# EasyEDA Pro project ProPrj_外接板20260112_2026-01-12.epro, schematic Schematic1
Board Name: Board1; Create Date: 2026-01-12; Page Name: P1; Project Name: 外接板20260112; Schematic Name: Schematic1; Update Date: 2026-01-12; Company: 嘉立创EDA; Page Size: A4; Version: V1.0
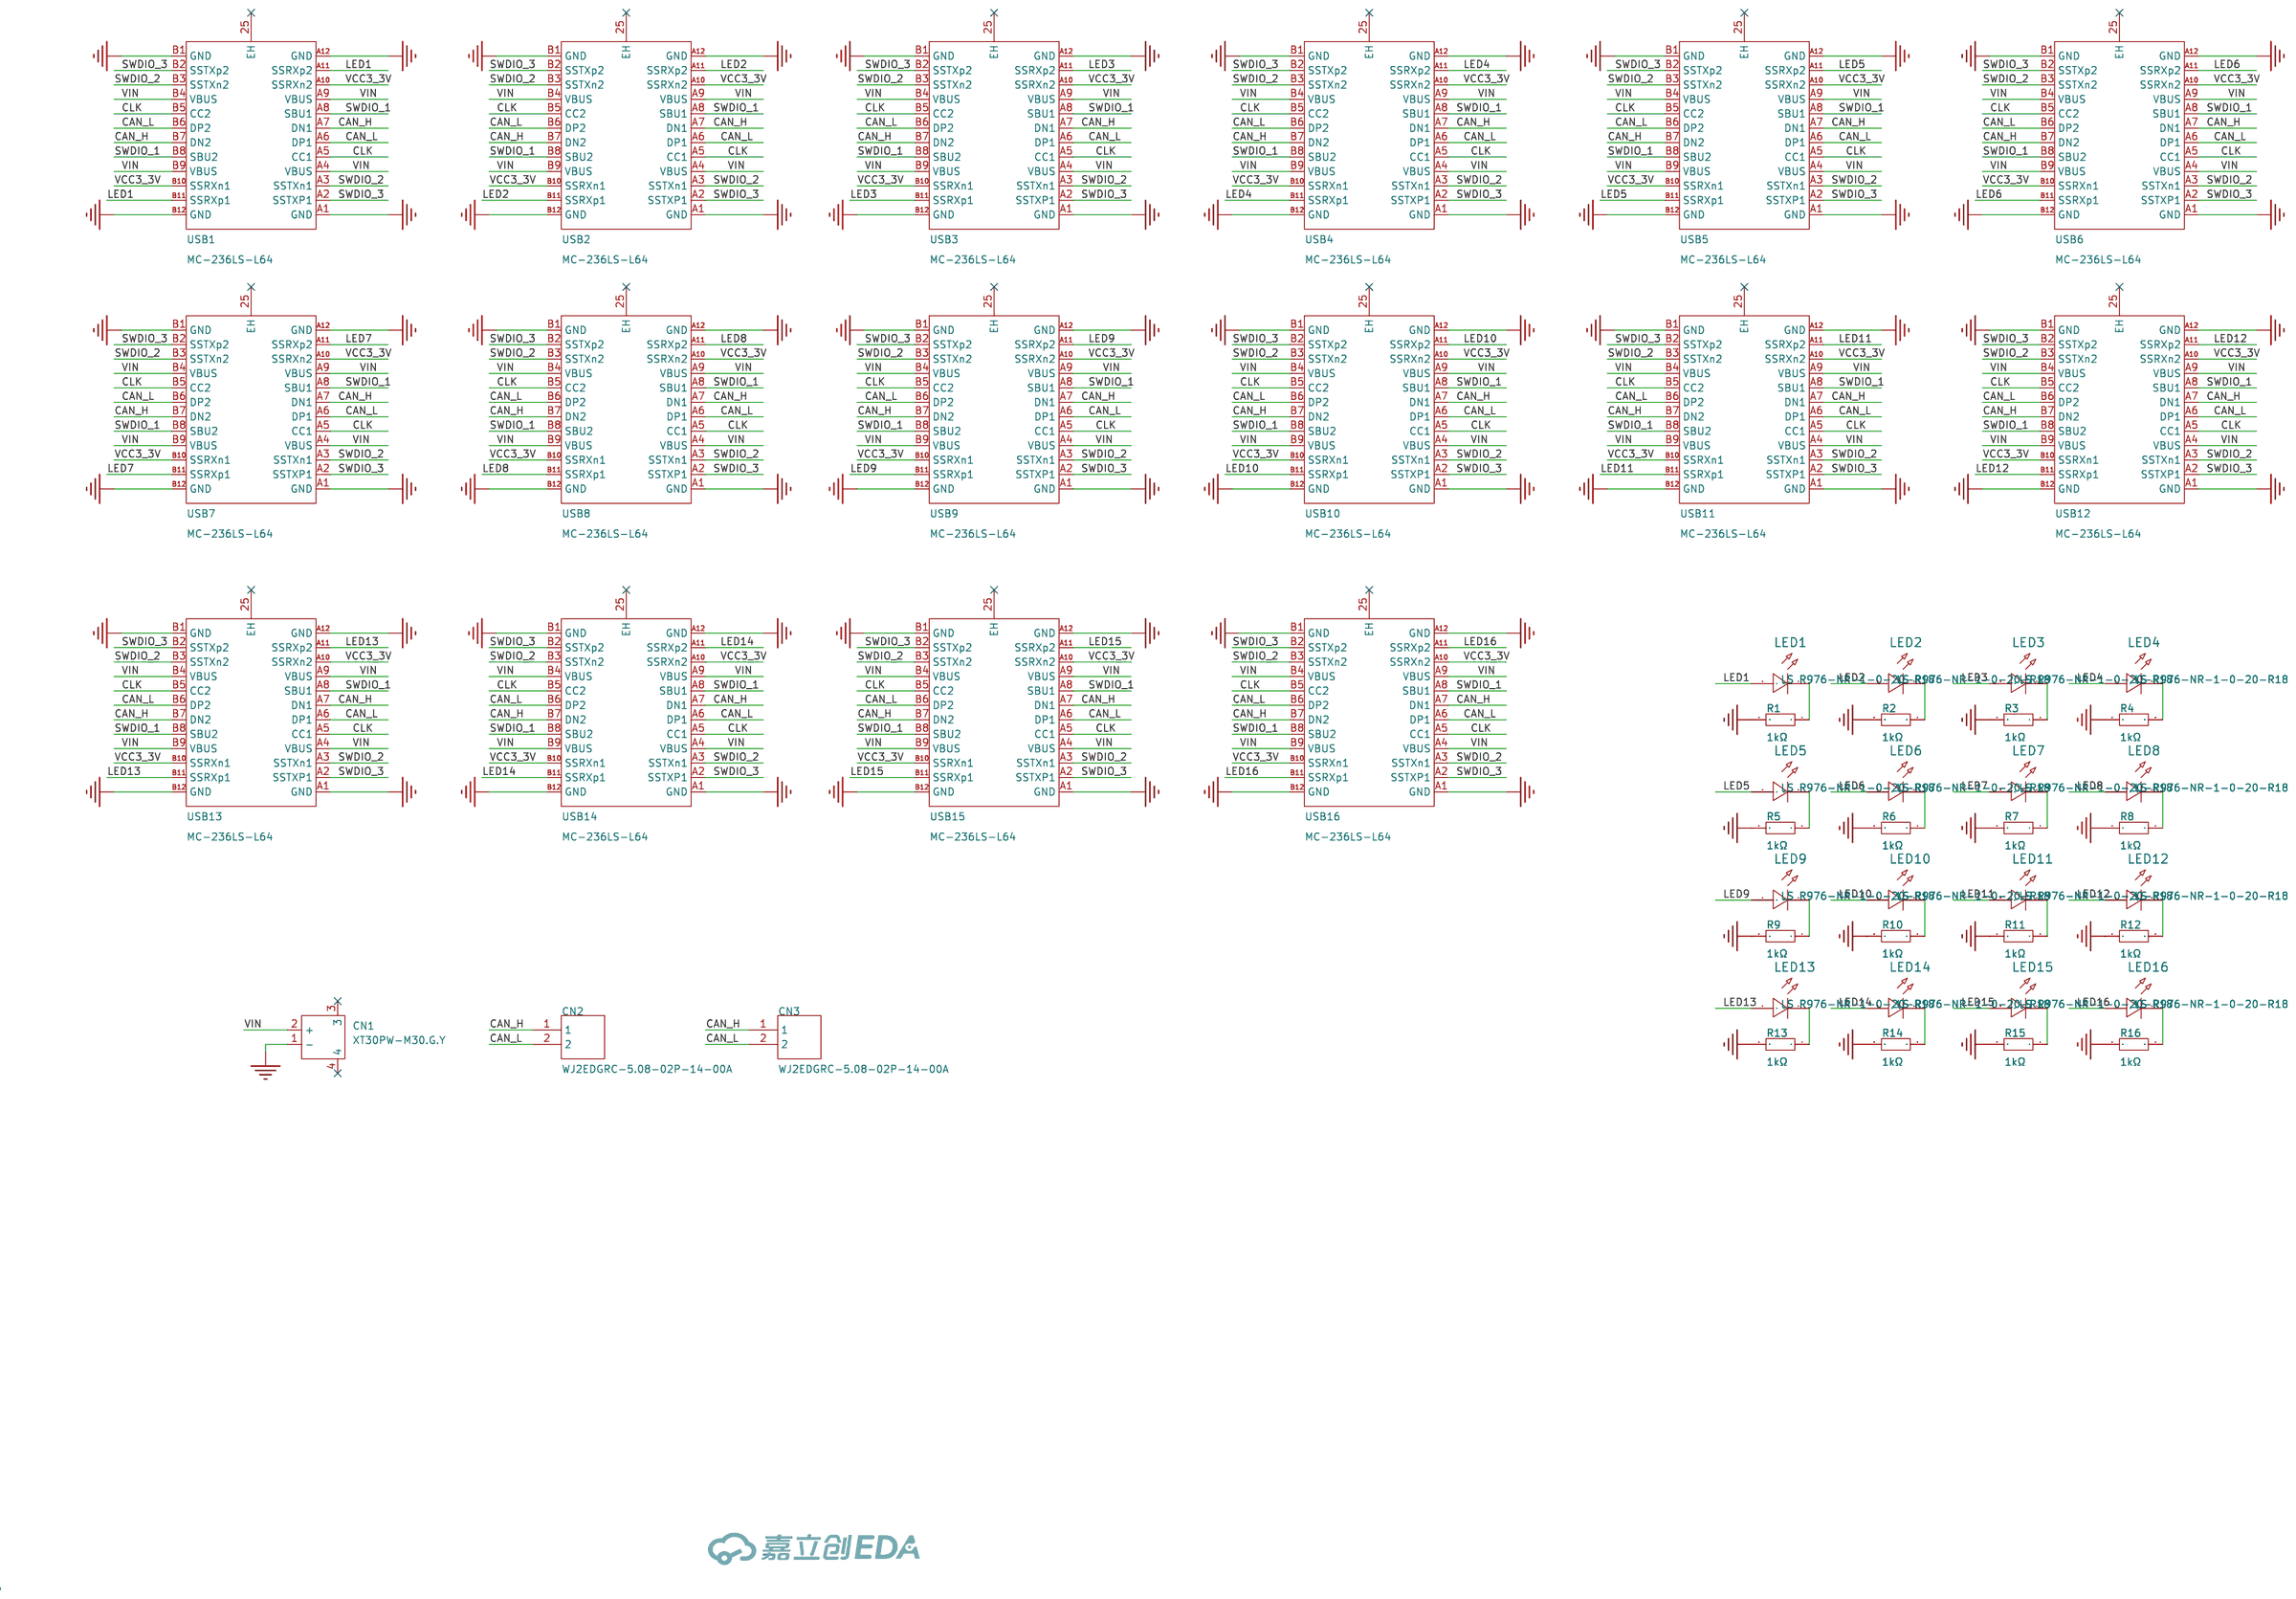
[diagram p0: schematic sheet]

## Parts
CN1  XT30PW-M30.G.Y  [CONN-TH_XT30PW-M]
CN2  WJ2EDGRC-5.08-02P-14-00A  [CONN-TH_2P-P5.08_WJ2EDGRC-5.08-2P]
CN3  WJ2EDGRC-5.08-02P-14-00A  [CONN-TH_2P-P5.08_WJ2EDGRC-5.08-2P]
LED1  LS R976-NR-1-0-20-R18  [LED0805-RD_RED]
LED2  LS R976-NR-1-0-20-R18  [LED0805-RD_RED]
LED3  LS R976-NR-1-0-20-R18  [LED0805-RD_RED]
LED4  LS R976-NR-1-0-20-R18  [LED0805-RD_RED]
LED5  LS R976-NR-1-0-20-R18  [LED0805-RD_RED]
LED6  LS R976-NR-1-0-20-R18  [LED0805-RD_RED]
LED7  LS R976-NR-1-0-20-R18  [LED0805-RD_RED]
LED8  LS R976-NR-1-0-20-R18  [LED0805-RD_RED]
LED9  LS R976-NR-1-0-20-R18  [LED0805-RD_RED]
LED10  LS R976-NR-1-0-20-R18  [LED0805-RD_RED]
LED11  LS R976-NR-1-0-20-R18  [LED0805-RD_RED]
LED12  LS R976-NR-1-0-20-R18  [LED0805-RD_RED]
LED13  LS R976-NR-1-0-20-R18  [LED0805-RD_RED]
LED14  LS R976-NR-1-0-20-R18  [LED0805-RD_RED]
LED15  LS R976-NR-1-0-20-R18  [LED0805-RD_RED]
LED16  LS R976-NR-1-0-20-R18  [LED0805-RD_RED]
R1  1kΩ  [R0805]
R2  1kΩ  [R0805]
R3  1kΩ  [R0805]
R4  1kΩ  [R0805]
R5  1kΩ  [R0805]
R6  1kΩ  [R0805]
R7  1kΩ  [R0805]
R8  1kΩ  [R0805]
R9  1kΩ  [R0805]
R10  1kΩ  [R0805]
R11  1kΩ  [R0805]
R12  1kΩ  [R0805]
R13  1kΩ  [R0805]
R14  1kΩ  [R0805]
R15  1kΩ  [R0805]
R16  1kΩ  [R0805]
USB1  MC-236LS-L64  [TYPE-C-USB-SMD_TYPE-C-31-M-06]
USB2  MC-236LS-L64  [TYPE-C-USB-SMD_TYPE-C-31-M-06]
USB3  MC-236LS-L64  [TYPE-C-USB-SMD_TYPE-C-31-M-06]
USB4  MC-236LS-L64  [TYPE-C-USB-SMD_TYPE-C-31-M-06]
USB5  MC-236LS-L64  [TYPE-C-USB-SMD_TYPE-C-31-M-06]
USB6  MC-236LS-L64  [TYPE-C-USB-SMD_TYPE-C-31-M-06]
USB7  MC-236LS-L64  [TYPE-C-USB-SMD_TYPE-C-31-M-06]
USB8  MC-236LS-L64  [TYPE-C-USB-SMD_TYPE-C-31-M-06]
USB9  MC-236LS-L64  [TYPE-C-USB-SMD_TYPE-C-31-M-06]
USB10  MC-236LS-L64  [TYPE-C-USB-SMD_TYPE-C-31-M-06]
USB11  MC-236LS-L64  [TYPE-C-USB-SMD_TYPE-C-31-M-06]
USB12  MC-236LS-L64  [TYPE-C-USB-SMD_TYPE-C-31-M-06]
USB13  MC-236LS-L64  [TYPE-C-USB-SMD_TYPE-C-31-M-06]
USB14  MC-236LS-L64  [TYPE-C-USB-SMD_TYPE-C-31-M-06]
USB15  MC-236LS-L64  [TYPE-C-USB-SMD_TYPE-C-31-M-06]
USB16  MC-236LS-L64  [TYPE-C-USB-SMD_TYPE-C-31-M-06]

## Library data of the parts
CN1 = XT30PW-M30.G.Y: 类别:-;类型1:-;; LCSC Part Name: AMASS(艾迈斯)航模插头 卧式弯脚 XT30PW-M公头; Supplier Part: C431092; Manufacturer: AMASS(艾迈斯); JLCPCB Part Class: 扩展库; Datasheet: https://item.szlcsc.com/datasheet/XT30PW-M30.G.Y/426930.html; Supplier: LCSC; Type: 航模插头; RatedVoltage: DC 500V; InterfaceType: 公头; RatedCurrent: 15A; RecommendedWireGauge: 16/18/20AWG; contact resistance: 1.2mΩ; specifications: 2pin
CN2 CN3 = WJ2EDGRC-5.08-2P: 连接器类型:板端/插座-闭口;固定方式:卡扣固定;结构:1x2P;间距:5.08mm;颜色:绿色;安装方式:弯针;排数:1;每排PIN数:2;额定电流:10A;额定电压:300V;线规 - AWG:-;线规 - 平方毫米:-;工作温度:-40℃~+105℃;; LCSC Part Name: 卡扣固定 1x2P 5.08mm 排数:1 每排P数:2; Supplier Part: C3697; Manufacturer: KANGNEX(康奈克斯电气); Supplier Footprint: 弯插,P=5.08mm; JLCPCB Part Class: Extended Part; Datasheet: https://item.szlcsc.com/datasheet/WJ2EDGRC-5.08-02P-14-00A/4099.html; Supplier: LCSC; Connector Type: 板端/插座-闭口; Structure: 1x2P; Pitch: 5.08mm; Color: 绿色; Mounting Style: 弯针; Number of Pins: 2P; Number of Rows: 1; Number of PINs Per Row: 2; Current Rating (Max): 20A; Voltage Rating (Max): 300V; Contact Material: 黄铜; Contact Plating: 锡; Operating Temperature Range: -40℃~+105℃; Termination Style: 卡扣固定; Number of Positions or Pins: 1x2P; Mounting Type: 弯针; Current Rating: 10A; Operating Temperature: -40℃~+105℃
LED1-LED16 = LS R976-NR-1-0-20-R18: 发光颜色:红色;正向压降(Vf):2V;正向电流:20mA;波长:625nm~650nm;透镜颜色:雾状白色透镜;发光强度:180mcd;发光角度:160°;工作温度:-30℃~+85℃;; LCSC Part Name: 0805红(雾状); Supplier Part: C2899997; Manufacturer: OSRAM(欧司朗); Supplier Footprint: 0805; JLCPCB Part Class: Extended Part; Datasheet: https://item.szlcsc.com/datasheet/LS%2520R976-NR-1-0-20-R18/3147924.html; Supplier: LCSC; Illumination Color: 红色; Voltage - Forward(Vf): 2V; Forward Current: 20mA; Wavelength - Dominant: 625nm~650nm; Peak Wavelength: 645nm; Lens Color: 雾状白色透镜; Luminous Intensity: 180mcd; Viewing Angle: 160°; Operating Temperature: -30℃~+85℃
R1-R16 = 0805W8F1001T5E: 电阻类型:厚膜电阻;阻值:1kΩ;精度:±1%;功率:125mW;最大工作电压:150V;温度系数:±100ppm/℃;; LCSC Part Name: 1kΩ ±1% 125mW 厚膜电阻; Supplier Part: C17513; Manufacturer: UNI-ROYAL(厚声); Supplier Footprint: 0805; JLCPCB Part Class: Basic Part; Datasheet: https://atta.szlcsc.com/upload/public/pdf/source/20200306/C422600_1E6D84923E4A46A82E41ADD87F860B5C.pdf; Supplier: LCSC; Type: 厚膜电阻; Tolerance: ±1%; Power(Watts): 125mW; Overload Voltage (Max): 150V; Temperature Coefficient: ±100ppm/℃; Operating Temperature Range: -55℃~+155℃
USB1-USB16 = MC-236LS-L64: 连接器类型:Type-C;协议标准:USB 3.1;公母:母;安装方式:立贴;触点数量:24P;端口数量:1;额定电流 - 电源:5A;工作温度:-25℃~+85℃;; LCSC Part Name: Type-C 母 立贴; Supplier Part: C3039314; Manufacturer: HANBO(汉博); Supplier Footprint: SMD; JLCPCB Part Class: 扩展库; Datasheet: https://item.szlcsc.com/datasheet/MC-236LS-L64/3592990.html; Supplier: LCSC; Connector Type: Type-C; Protocol Standard: USB 3.1; Gender: 母; Mounting Type: 立贴; Number of Contacts: 24P; Number of Ports: 1; Current Rating-Power: 5A; Voltage Rating: 5V; Connect-Disconnect Life: 1万次; Operating Temperature: -25℃~+85℃

## Nets
GND: CN1.1(-) R1.2 R2.2 R3.2 R4.2 R5.2 R6.2 R7.2 R8.2 R9.2 R10.2 R11.2 R12.2 R13.2 R14.2 R15.2 R16.2 USB1.A1(GND) USB1.A12(GND) USB1.B1(GND) USB1.B12(GND) USB2.A1(GND) USB2.A12(GND) USB2.B1(GND) USB2.B12(GND) USB3.A1(GND) USB3.A12(GND) USB3.B1(GND) USB3.B12(GND) USB4.A1(GND) USB4.A12(GND) USB4.B1(GND) USB4.B12(GND) USB5.A1(GND) USB5.A12(GND) USB5.B1(GND) USB5.B12(GND) USB6.A1(GND) USB6.A12(GND) USB6.B1(GND) USB6.B12(GND) USB7.A1(GND) USB7.A12(GND) USB7.B1(GND) USB7.B12(GND) USB8.A1(GND) USB8.A12(GND) USB8.B1(GND) USB8.B12(GND) USB9.A1(GND) USB9.A12(GND) USB9.B1(GND) USB9.B12(GND) USB10.A1(GND) USB10.A12(GND) USB10.B1(GND) USB10.B12(GND) USB11.A1(GND) USB11.A12(GND) USB11.B1(GND) USB11.B12(GND) USB12.A1(GND) USB12.A12(GND) USB12.B1(GND) USB12.B12(GND) USB13.A1(GND) USB13.A12(GND) USB13.B1(GND) USB13.B12(GND) USB14.A1(GND) USB14.A12(GND) USB14.B1(GND) USB14.B12(GND) USB15.A1(GND) USB15.A12(GND) USB15.B1(GND) USB15.B12(GND) USB16.A1(GND) USB16.A12(GND) USB16.B1(GND) USB16.B12(GND)
VCC3_3V: USB1.A10(SSRXn2) USB1.B10(SSRXn1) USB2.A10(SSRXn2) USB2.B10(SSRXn1) USB3.A10(SSRXn2) USB3.B10(SSRXn1) USB4.A10(SSRXn2) USB4.B10(SSRXn1) USB5.A10(SSRXn2) USB5.B10(SSRXn1) USB6.A10(SSRXn2) USB6.B10(SSRXn1) USB7.A10(SSRXn2) USB7.B10(SSRXn1) USB8.A10(SSRXn2) USB8.B10(SSRXn1) USB9.A10(SSRXn2) USB9.B10(SSRXn1) USB10.A10(SSRXn2) USB10.B10(SSRXn1) USB11.A10(SSRXn2) USB11.B10(SSRXn1) USB12.A10(SSRXn2) USB12.B10(SSRXn1) USB13.A10(SSRXn2) USB13.B10(SSRXn1) USB14.A10(SSRXn2) USB14.B10(SSRXn1) USB15.A10(SSRXn2) USB15.B10(SSRXn1) USB16.A10(SSRXn2) USB16.B10(SSRXn1)
VIN: CN1.2(+) USB1.A4(VBUS) USB1.A9(VBUS) USB1.B4(VBUS) USB1.B9(VBUS) USB2.A4(VBUS) USB2.A9(VBUS) USB2.B4(VBUS) USB2.B9(VBUS) USB3.A4(VBUS) USB3.A9(VBUS) USB3.B4(VBUS) USB3.B9(VBUS) USB4.A4(VBUS) USB4.A9(VBUS) USB4.B4(VBUS) USB4.B9(VBUS) USB5.A4(VBUS) USB5.A9(VBUS) USB5.B4(VBUS) USB5.B9(VBUS) USB6.A4(VBUS) USB6.A9(VBUS) USB6.B4(VBUS) USB6.B9(VBUS) USB7.A4(VBUS) USB7.A9(VBUS) USB7.B4(VBUS) USB7.B9(VBUS) USB8.A4(VBUS) USB8.A9(VBUS) USB8.B4(VBUS) USB8.B9(VBUS) USB9.A4(VBUS) USB9.A9(VBUS) USB9.B4(VBUS) USB9.B9(VBUS) USB10.A4(VBUS) USB10.A9(VBUS) USB10.B4(VBUS) USB10.B9(VBUS) USB11.A4(VBUS) USB11.A9(VBUS) USB11.B4(VBUS) USB11.B9(VBUS) USB12.A4(VBUS) USB12.A9(VBUS) USB12.B4(VBUS) USB12.B9(VBUS) USB13.A4(VBUS) USB13.A9(VBUS) USB13.B4(VBUS) USB13.B9(VBUS) USB14.A4(VBUS) USB14.A9(VBUS) USB14.B4(VBUS) USB14.B9(VBUS) USB15.A4(VBUS) USB15.A9(VBUS) USB15.B4(VBUS) USB15.B9(VBUS) USB16.A4(VBUS) USB16.A9(VBUS) USB16.B4(VBUS) USB16.B9(VBUS)
CAN_H: CN2.1 CN3.1 USB1.A7(DN1) USB1.B7(DN2) USB2.A7(DN1) USB2.B7(DN2) USB3.A7(DN1) USB3.B7(DN2) USB4.A7(DN1) USB4.B7(DN2) USB5.A7(DN1) USB5.B7(DN2) USB6.A7(DN1) USB6.B7(DN2) USB7.A7(DN1) USB7.B7(DN2) USB8.A7(DN1) USB8.B7(DN2) USB9.A7(DN1) USB9.B7(DN2) USB10.A7(DN1) USB10.B7(DN2) USB11.A7(DN1) USB11.B7(DN2) USB12.A7(DN1) USB12.B7(DN2) USB13.A7(DN1) USB13.B7(DN2) USB14.A7(DN1) USB14.B7(DN2) USB15.A7(DN1) USB15.B7(DN2) USB16.A7(DN1) USB16.B7(DN2)
CAN_L: CN2.2 CN3.2 USB1.A6(DP1) USB1.B6(DP2) USB2.A6(DP1) USB2.B6(DP2) USB3.A6(DP1) USB3.B6(DP2) USB4.A6(DP1) USB4.B6(DP2) USB5.A6(DP1) USB5.B6(DP2) USB6.A6(DP1) USB6.B6(DP2) USB7.A6(DP1) USB7.B6(DP2) USB8.A6(DP1) USB8.B6(DP2) USB9.A6(DP1) USB9.B6(DP2) USB10.A6(DP1) USB10.B6(DP2) USB11.A6(DP1) USB11.B6(DP2) USB12.A6(DP1) USB12.B6(DP2) USB13.A6(DP1) USB13.B6(DP2) USB14.A6(DP1) USB14.B6(DP2) USB15.A6(DP1) USB15.B6(DP2) USB16.A6(DP1) USB16.B6(DP2)
CLK: USB1.A5(CC1) USB1.B5(CC2) USB2.A5(CC1) USB2.B5(CC2) USB3.A5(CC1) USB3.B5(CC2) USB4.A5(CC1) USB4.B5(CC2) USB5.A5(CC1) USB5.B5(CC2) USB6.A5(CC1) USB6.B5(CC2) USB7.A5(CC1) USB7.B5(CC2) USB8.A5(CC1) USB8.B5(CC2) USB9.A5(CC1) USB9.B5(CC2) USB10.A5(CC1) USB10.B5(CC2) USB11.A5(CC1) USB11.B5(CC2) USB12.A5(CC1) USB12.B5(CC2) USB13.A5(CC1) USB13.B5(CC2) USB14.A5(CC1) USB14.B5(CC2) USB15.A5(CC1) USB15.B5(CC2) USB16.A5(CC1) USB16.B5(CC2)
LED1: LED1.2(A) USB1.A11(SSRXp2) USB1.B11(SSRXp1)
LED2: LED2.2(A) USB2.A11(SSRXp2) USB2.B11(SSRXp1)
LED3: LED3.2(A) USB3.A11(SSRXp2) USB3.B11(SSRXp1)
LED4: LED4.2(A) USB4.A11(SSRXp2) USB4.B11(SSRXp1)
LED5: LED5.2(A) USB5.A11(SSRXp2) USB5.B11(SSRXp1)
LED6: LED6.2(A) USB6.A11(SSRXp2) USB6.B11(SSRXp1)
LED7: LED7.2(A) USB7.A11(SSRXp2) USB7.B11(SSRXp1)
LED8: LED8.2(A) USB8.A11(SSRXp2) USB8.B11(SSRXp1)
LED9: LED9.2(A) USB9.A11(SSRXp2) USB9.B11(SSRXp1)
LED10: LED10.2(A) USB10.A11(SSRXp2) USB10.B11(SSRXp1)
LED11: LED11.2(A) USB11.A11(SSRXp2) USB11.B11(SSRXp1)
LED12: LED12.2(A) USB12.A11(SSRXp2) USB12.B11(SSRXp1)
LED13: LED13.2(A) USB13.A11(SSRXp2) USB13.B11(SSRXp1)
LED14: LED14.2(A) USB14.A11(SSRXp2) USB14.B11(SSRXp1)
LED15: LED15.2(A) USB15.A11(SSRXp2) USB15.B11(SSRXp1)
LED16: LED16.2(A) USB16.A11(SSRXp2) USB16.B11(SSRXp1)
SWDIO_1: USB1.A8(SBU1) USB1.B8(SBU2) USB2.A8(SBU1) USB2.B8(SBU2) USB3.A8(SBU1) USB3.B8(SBU2) USB4.A8(SBU1) USB4.B8(SBU2) USB5.A8(SBU1) USB5.B8(SBU2) USB6.A8(SBU1) USB6.B8(SBU2) USB7.A8(SBU1) USB7.B8(SBU2) USB8.A8(SBU1) USB8.B8(SBU2) USB9.A8(SBU1) USB9.B8(SBU2) USB10.A8(SBU1) USB10.B8(SBU2) USB11.A8(SBU1) USB11.B8(SBU2) USB12.A8(SBU1) USB12.B8(SBU2) USB13.A8(SBU1) USB13.B8(SBU2) USB14.A8(SBU1) USB14.B8(SBU2) USB15.A8(SBU1) USB15.B8(SBU2) USB16.A8(SBU1) USB16.B8(SBU2)
SWDIO_2: USB1.A3(SSTXn1) USB1.B3(SSTXn2) USB2.A3(SSTXn1) USB2.B3(SSTXn2) USB3.A3(SSTXn1) USB3.B3(SSTXn2) USB4.A3(SSTXn1) USB4.B3(SSTXn2) USB5.A3(SSTXn1) USB5.B3(SSTXn2) USB6.A3(SSTXn1) USB6.B3(SSTXn2) USB7.A3(SSTXn1) USB7.B3(SSTXn2) USB8.A3(SSTXn1) USB8.B3(SSTXn2) USB9.A3(SSTXn1) USB9.B3(SSTXn2) USB10.A3(SSTXn1) USB10.B3(SSTXn2) USB11.A3(SSTXn1) USB11.B3(SSTXn2) USB12.A3(SSTXn1) USB12.B3(SSTXn2) USB13.A3(SSTXn1) USB13.B3(SSTXn2) USB14.A3(SSTXn1) USB14.B3(SSTXn2) USB15.A3(SSTXn1) USB15.B3(SSTXn2) USB16.A3(SSTXn1) USB16.B3(SSTXn2)
SWDIO_3: USB1.A2(SSTXP1) USB1.B2(SSTXp2) USB2.A2(SSTXP1) USB2.B2(SSTXp2) USB3.A2(SSTXP1) USB3.B2(SSTXp2) USB4.A2(SSTXP1) USB4.B2(SSTXp2) USB5.A2(SSTXP1) USB5.B2(SSTXp2) USB6.A2(SSTXP1) USB6.B2(SSTXp2) USB7.A2(SSTXP1) USB7.B2(SSTXp2) USB8.A2(SSTXP1) USB8.B2(SSTXp2) USB9.A2(SSTXP1) USB9.B2(SSTXp2) USB10.A2(SSTXP1) USB10.B2(SSTXp2) USB11.A2(SSTXP1) USB11.B2(SSTXp2) USB12.A2(SSTXP1) USB12.B2(SSTXp2) USB13.A2(SSTXP1) USB13.B2(SSTXp2) USB14.A2(SSTXP1) USB14.B2(SSTXp2) USB15.A2(SSTXP1) USB15.B2(SSTXp2) USB16.A2(SSTXP1) USB16.B2(SSTXp2)
$1N30340: LED1.1(C) R1.1
$1N30433: LED2.1(C) R2.1
$1N30567: LED3.1(C) R3.1
$1N30574: LED4.1(C) R4.1
$1N30835: LED5.1(C) R5.1
$1N30842: LED6.1(C) R6.1
$1N30849: LED7.1(C) R7.1
$1N30856: LED8.1(C) R8.1
$1N31119: LED9.1(C) R9.1
$1N31126: LED10.1(C) R10.1
$1N31133: LED11.1(C) R11.1
$1N31140: LED12.1(C) R12.1
$1N33758: LED15.1(C) R15.1
$1N33759: LED14.1(C) R14.1
$1N33762: LED16.1(C) R16.1
$1N33769: LED13.1(C) R13.1

Not connected (* = marked no-connect by the designer): CN1 3* 4*; USB1 25(EH)*; USB2 25(EH)*; USB3 25(EH)*; USB4 25(EH)*; USB5 25(EH)*; USB6 25(EH)*; USB7 25(EH)*; USB8 25(EH)*; USB9 25(EH)*; USB10 25(EH)*; USB11 25(EH)*; USB12 25(EH)*; USB13 25(EH)*; USB14 25(EH)*; USB15 25(EH)*; USB16 25(EH)*
